# Altium schematic sheet Supply 12V to 5V-7805 smd.SchDoc
size A
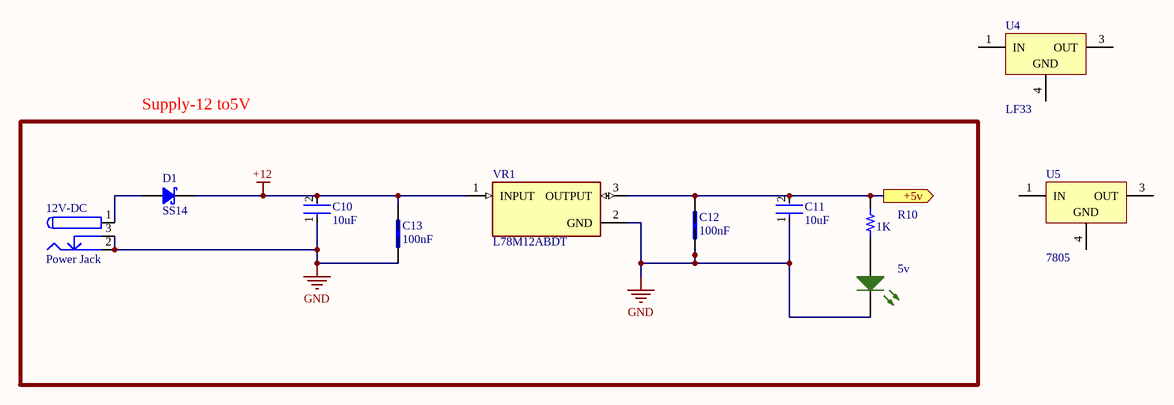
[diagram p0: Supply 12V to 5V-7805 smd.SchDoc]

## Parts
5v  LED SMD 0805 GREEN  [LED_0805_GREEN]  (value not drawn)
12V-DC  Power Jack  [DC005]
C10  10uF  [FP-C0805C-DN-IPC_B]
C11  10uF  [FP-C0805C-DN-IPC_A]
C12  100nF  [CAP 0805_2012]
C13  100nF  [CAP 0805_2012]
D1  SS14  [DO-214AC SMA]
R10  1K  [RES 0805_2012]
U4  LF33  [TO-252]
U5  7805  [TO-252]
VR1  L78M12ABDT  [VREG_L78M12ABDT]

## Blocks framed on the sheet
Supply-12 to5V: 5v 12V-DC C10-C13 D1 R10 VR1

## Ports
+5v (out)

## Nets
+12: C10.2 C13.2 D1.2 VR1.1(INPUT)
GND: 5v.2(K) 12V-DC.2 12V-DC.3 C10.1 C11.1 C12.1 C13.1 VR1.2(GND)
+5v: C11.2 C12.2 R10.1 VR1.3(OUTPUT) ; port +5v
Net5v_1: 5v.1(A) R10.2
Net12V-DC_1: 12V-DC.1 D1.1

Not connected (* = marked no-connect by the designer): U4 1(IN) 3(OUT) 4(GND); U5 1(IN) 3(OUT) 4(GND)

## Library data of the parts
12V-DC = Power Jack: PartNumber: DC005-5.5MM
C10 C11 = CMP-1036-04552-2: CAP CER 0.22UF 50V X7R 0805; Manufacturer: KEMET; Manufacturer Part Number: C0805C224K5RACTU; Value: 0.22 μF; Temperature Coefficient: 30ppm/°C; Material: Ceramic; Tolerance: 0.1; ComponentLink2URL: https://content.kemet.com/datasheets/KEM_C1003_C0G_SMD.pdf; Temperature Characteristic: X7R; Device Class L3: Ceramic Capacitors; Lead Free: Yes; Temperature: -55°C to +125°C; RoHS: TRUE; Capacitance: 0.22 μF; Automotive: No; Octopart: https://octopart.com/c0805c224k5ractu-kemet-144670; Temperature Range Low: -55°C; Height: 0.88mm; Device Class L1: Passive Components; Digikey Description: CAP CER 0.22UF 50V X7R 0805; ComponentLink2Description: Datasheet; Mouser Description: CAP CER 0.22UF 50V X7R 0805; Category: Cap; Ipc Land Pattern Name: CAPC200125X78; Temperature Range High: +125°C; Package: C0805C-DN; Device Class L2: Capacitors; Voltage Rating: 50 V
C12 C13 = LD051C182KAB2A: COMMERCIAL CHIP STD JAPAN BULK - FN TAPE/REEL, 7 INCH PAPER TAPE-0805; Package: None; Price: None; Value: *; MP: LD051C182KAB2A; Availability: Unavailable
D1 = SS14 (SMD SMA): Diode Schottky 40V 1A Surface Mount SMA (DO-214AC); PartNumber: SS14
R10 = Res 0805: SMT Resistor; VALUE: 1K
U4 = LF33 (SMD): 500mA, Very Low Drop (0.45V) Voltage Regulator, 3.3V, 3-Pin DPAK, Tape and Reel; PartNumber: LF33CDT-TR; DatasheetVersion: Nov-2010; PackageVersion: 2011; PackageReference: TO-252; PackageDescription: 3-Pin Transistor Outline Package 2.28 mm Pitch, 9.7 mm Lead Span (DPAK); ComponentLink1Description: Manufacturer URL; ComponentLink1URL: http://www.st.com; ComponentLink2Description: Datasheet; ComponentLink2URL: http://www.st.com/internet/com/TECHNICAL_RESOURCES/TECHNICAL_LITERATURE/DATASHEET/CD00000546.pdf
U5 = LM78M05 (SMD): Linear Voltage Regulator IC 1 Output 500mA TO-252-3; PartNumber: LM78M05CDTX/NOPB; Manufacturer: National Semiconductor; PowerWise: N; High-Reliability: Y; DatasheetVersion: Aug-2005; RoHS: Y; PinCount: 3; ComponentLink1Description: Manufacturer URL; ComponentLink1URL: http://www.national.com/; ComponentLink2Description: LM78M05 Datasheet; ComponentLink2URL: http://www.national.com/ds/LM/LM78M05.pdf; ComponentLink3Description: LM78M05 Web Page; ComponentLink3URL: http://www.national.com/pf/LM/LM78M05.html; ComponentLink4Description: T03B Package Page; ComponentLink4URL: http://www.national.com/packaging/folders/t03b.html
VR1 = L78M12ABDT: Linear Voltage Regulator IC Positive Fixed 1 Output 500mA DPAK; MF: STMicroelectronics; Package: TO-252 STMicroelectronics; Price: None; Value: *; SnapEDA_Link: https://www.snapeda.com/parts/L78M12ABDT/STMicroelectronics/view-part/?ref=snap; MP: L78M12ABDT; Availability: Not in stock; Check_prices: https://www.snapeda.com/parts/L78M12ABDT/STMicroelectronics/view-part/?ref=eda